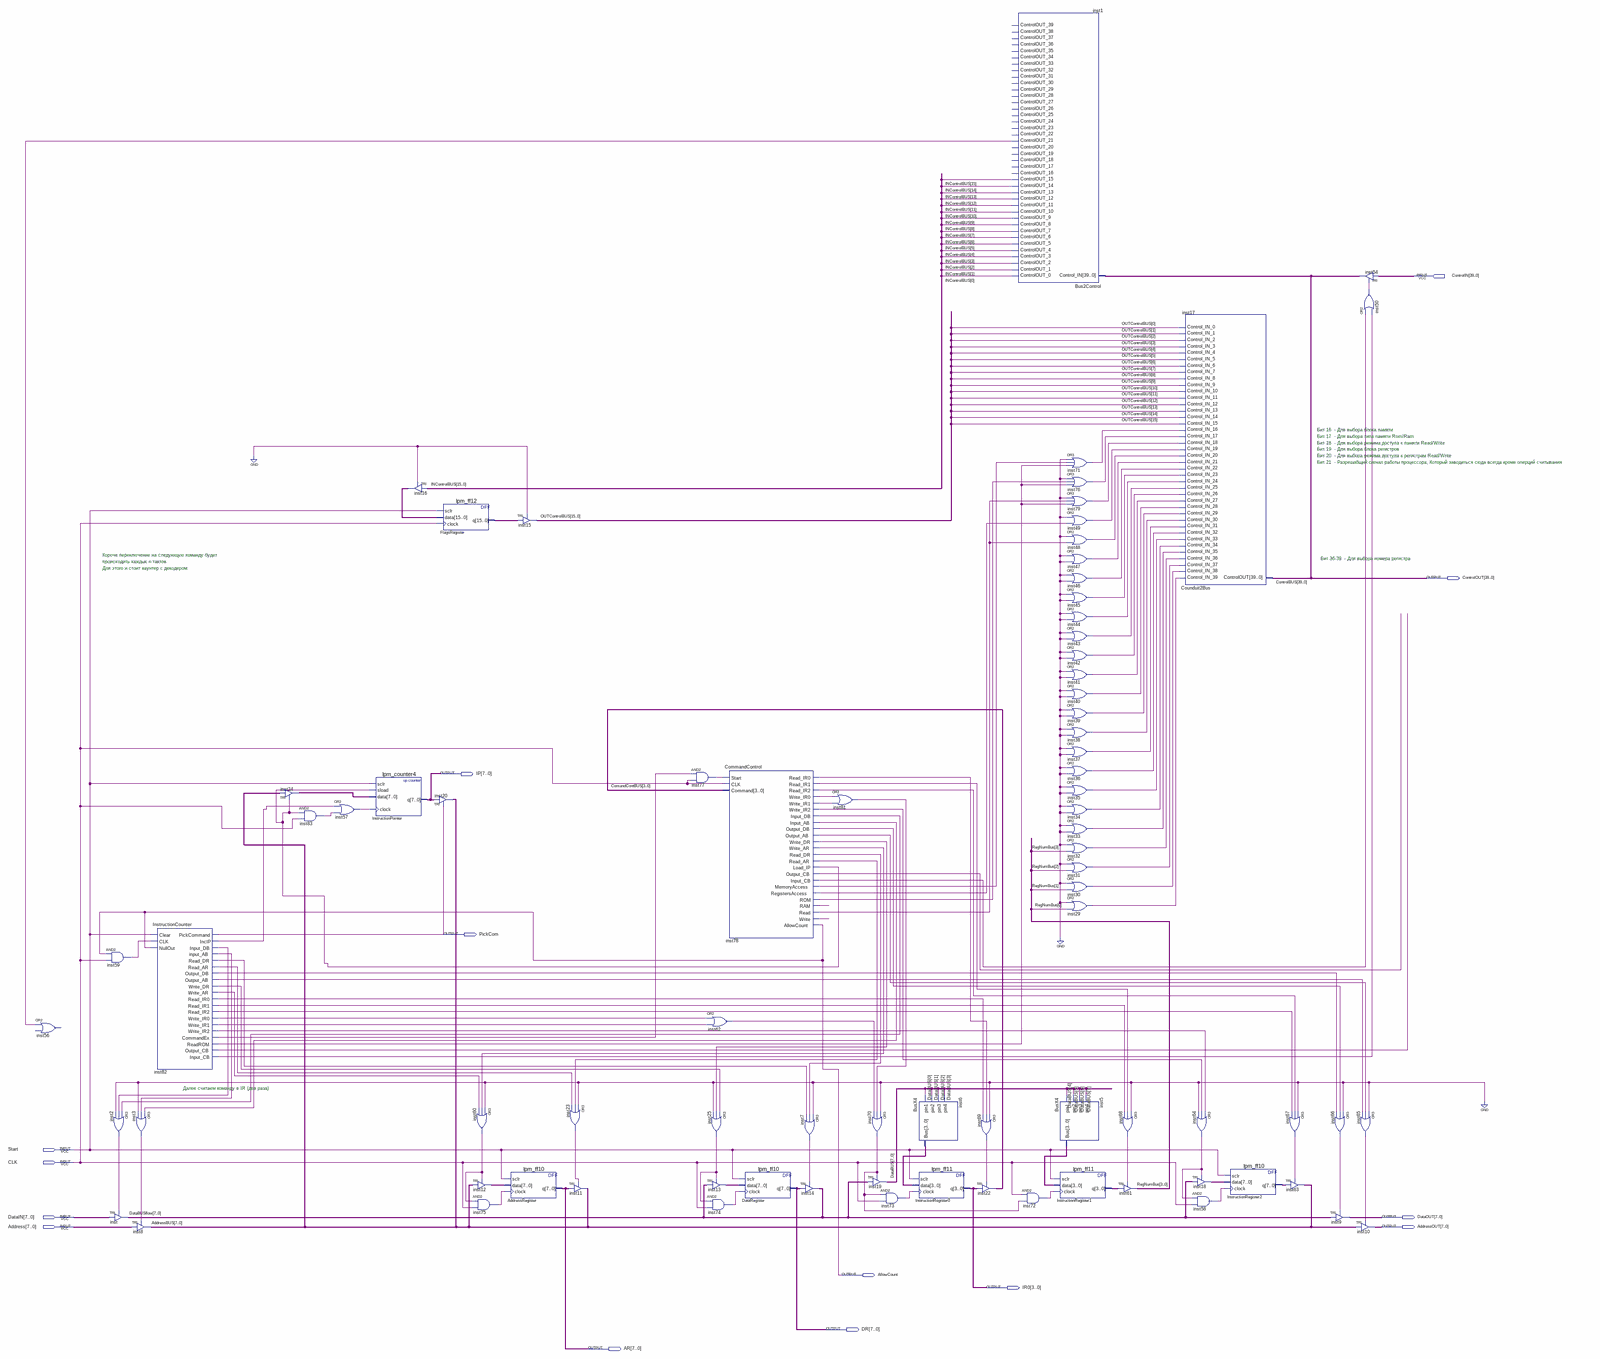
[diagram p0: schematic sheet, whole]
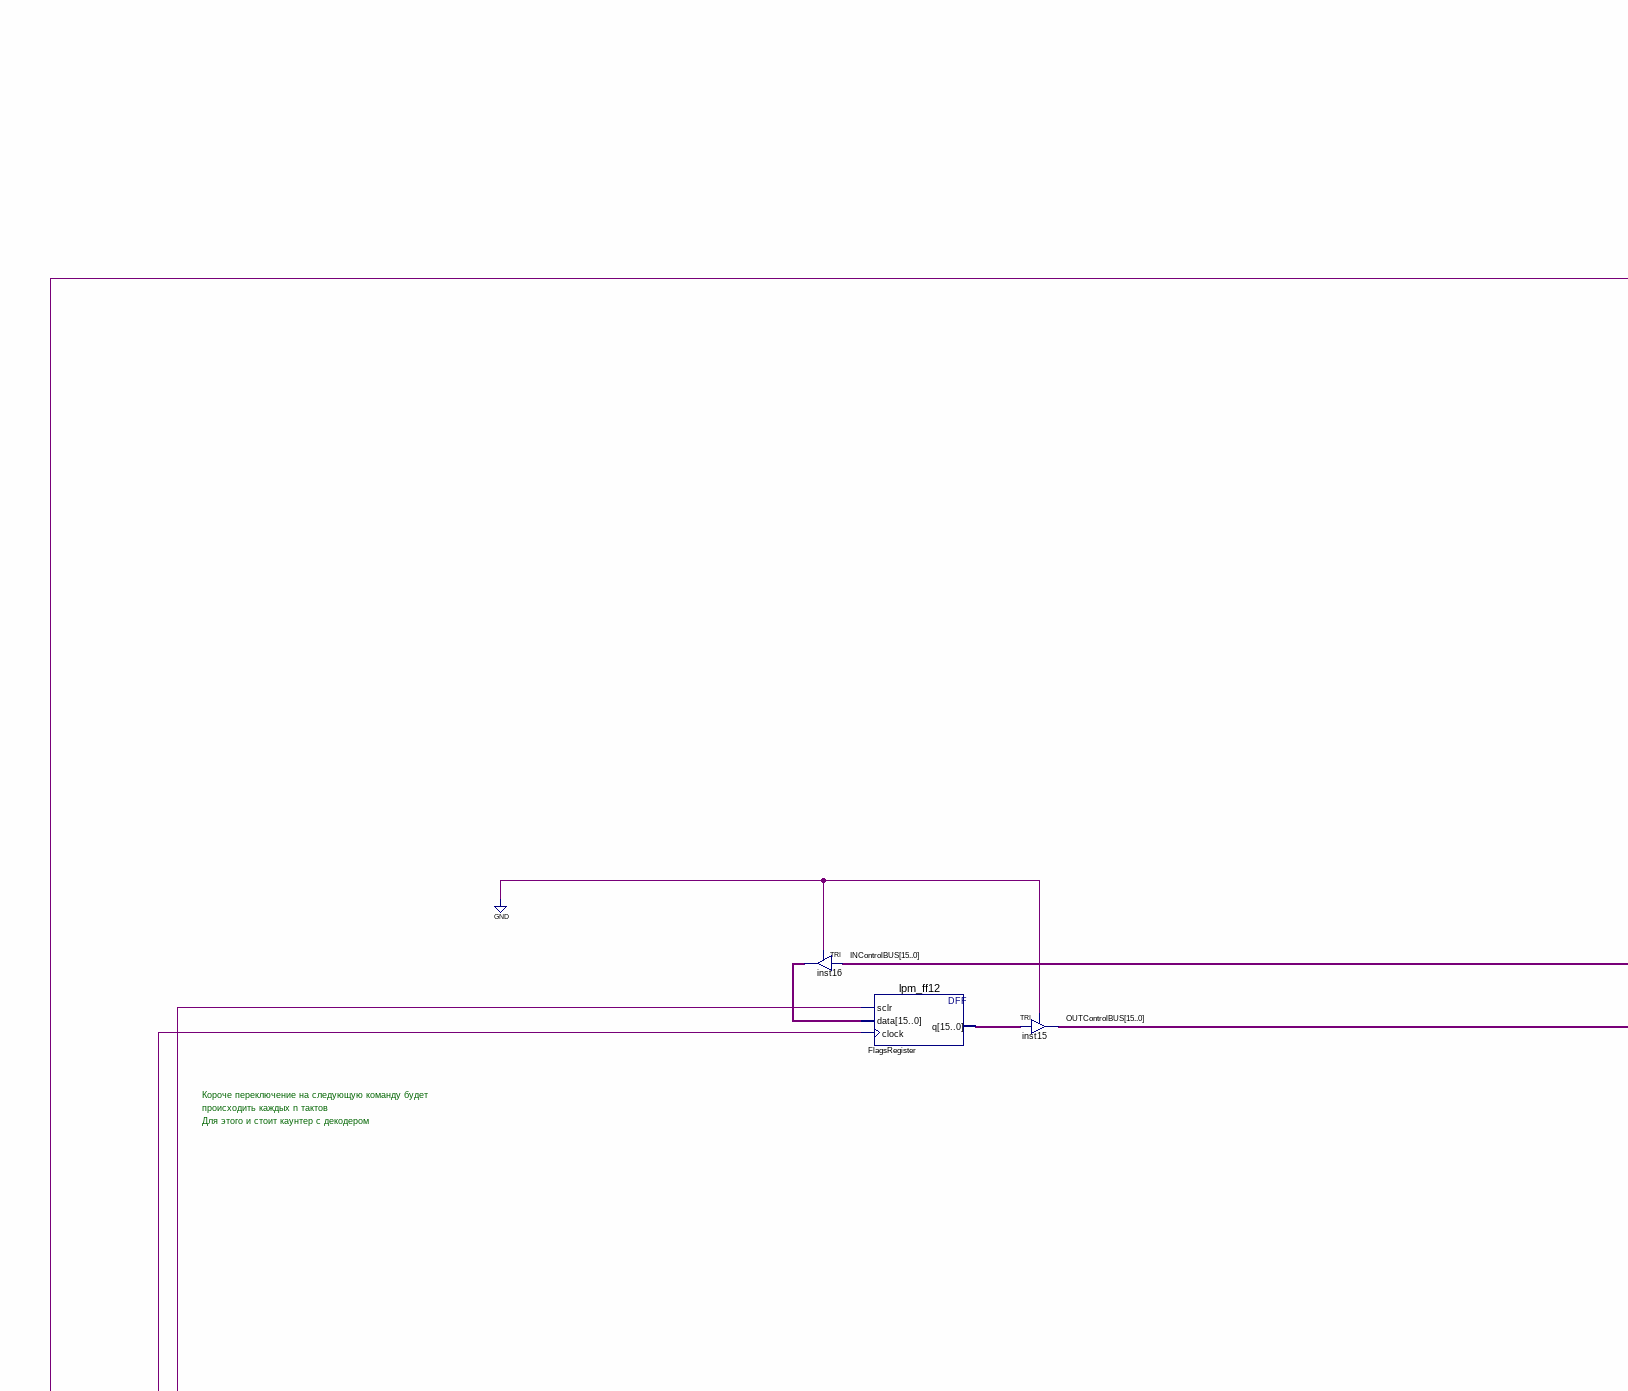
[diagram p1: schematic sheet, upper left part]
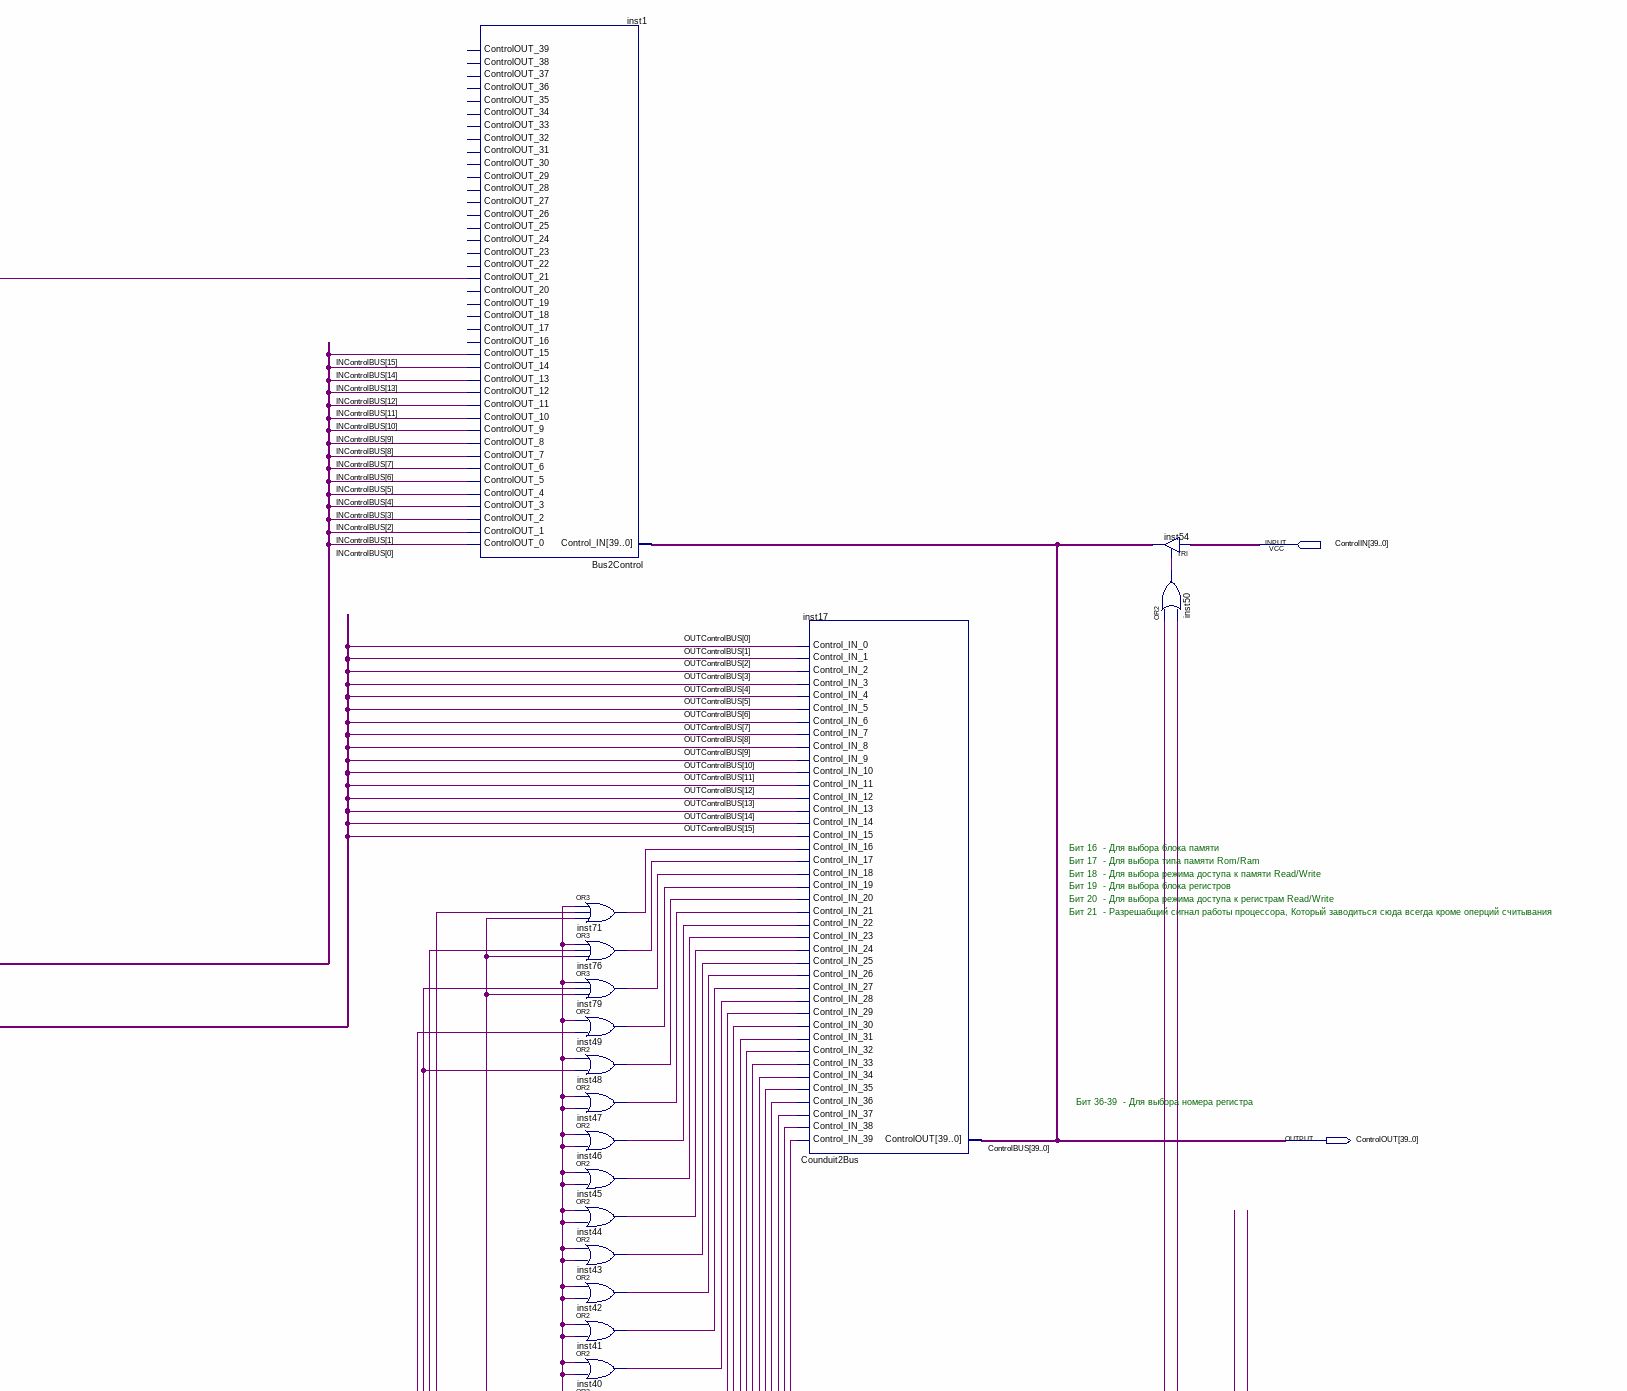
[diagram p2: schematic sheet, upper right part]
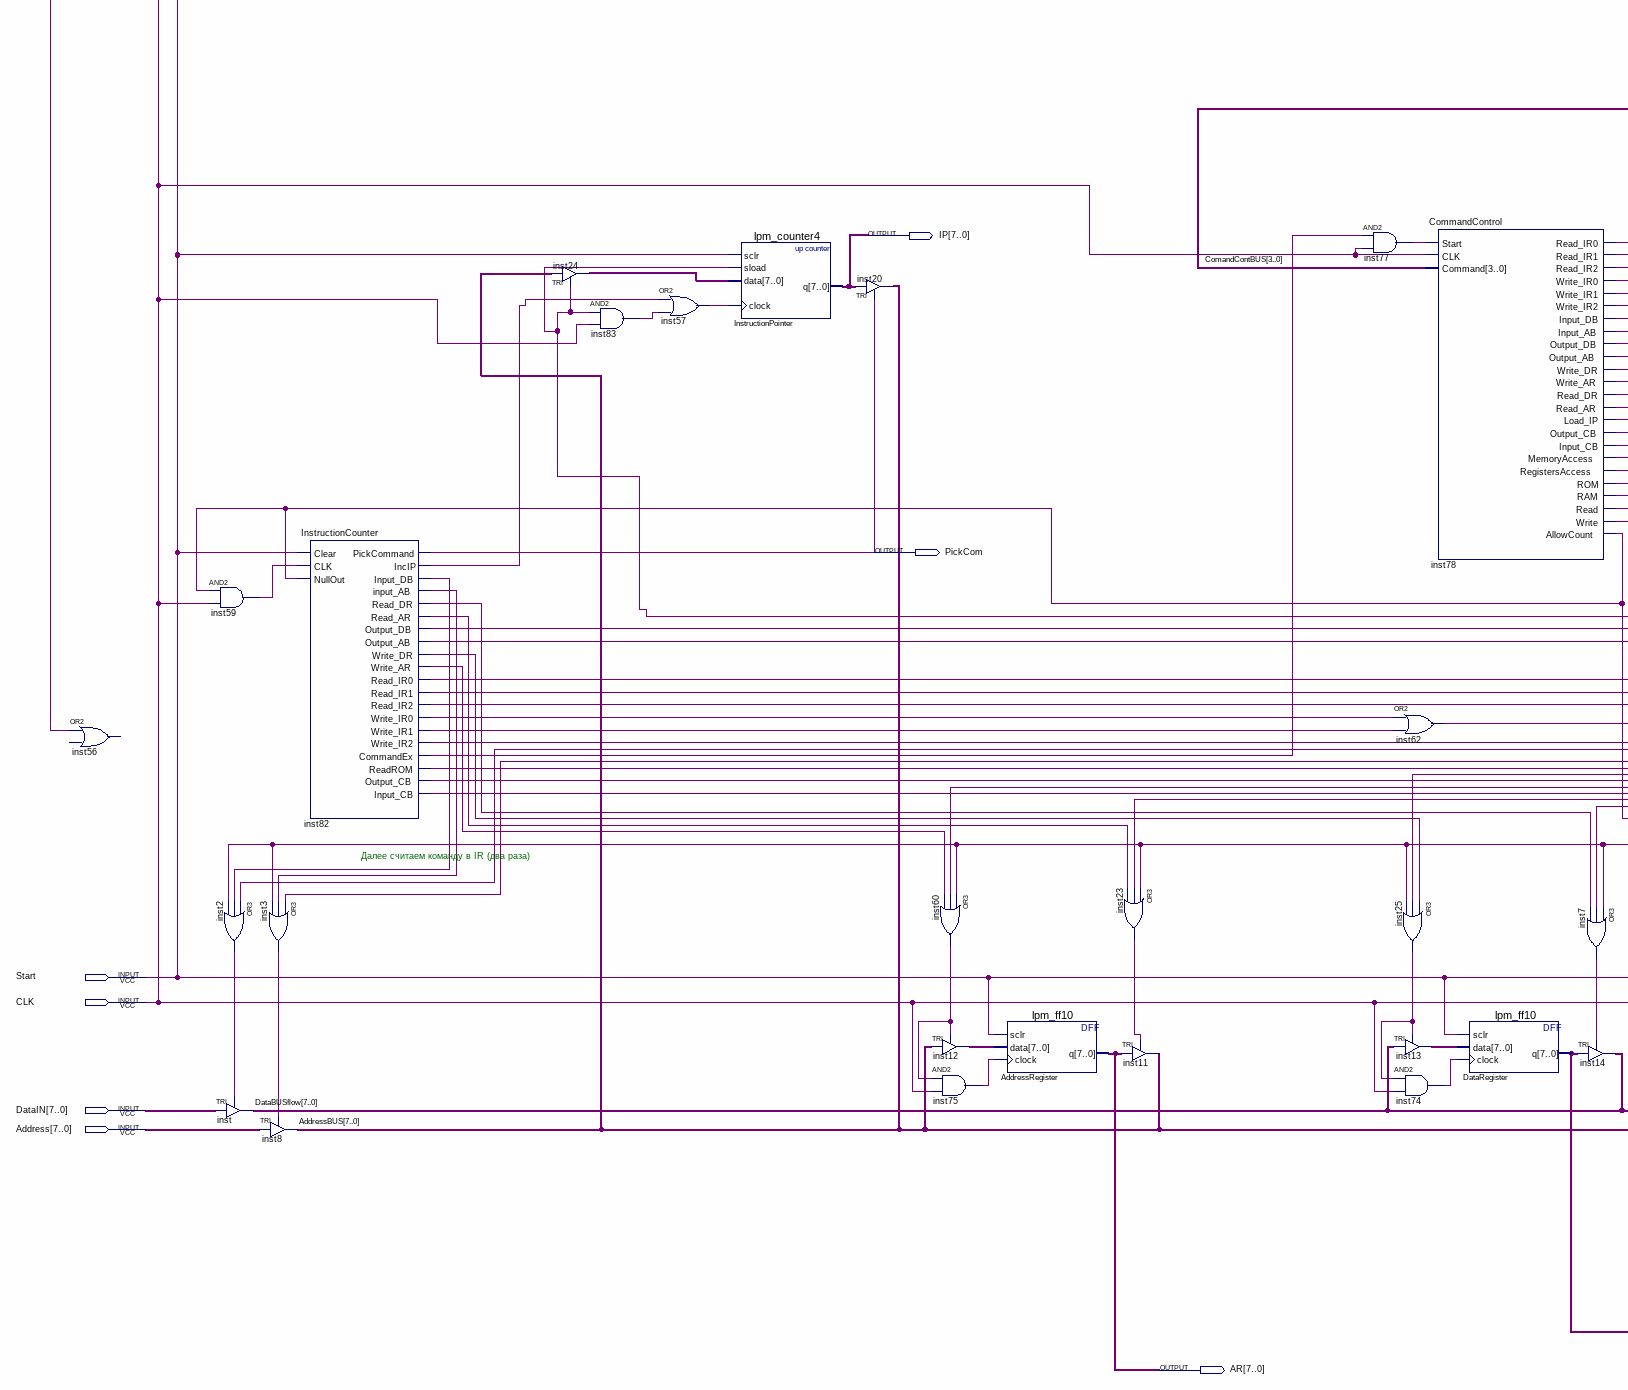
[diagram p3: schematic sheet, lower left part]
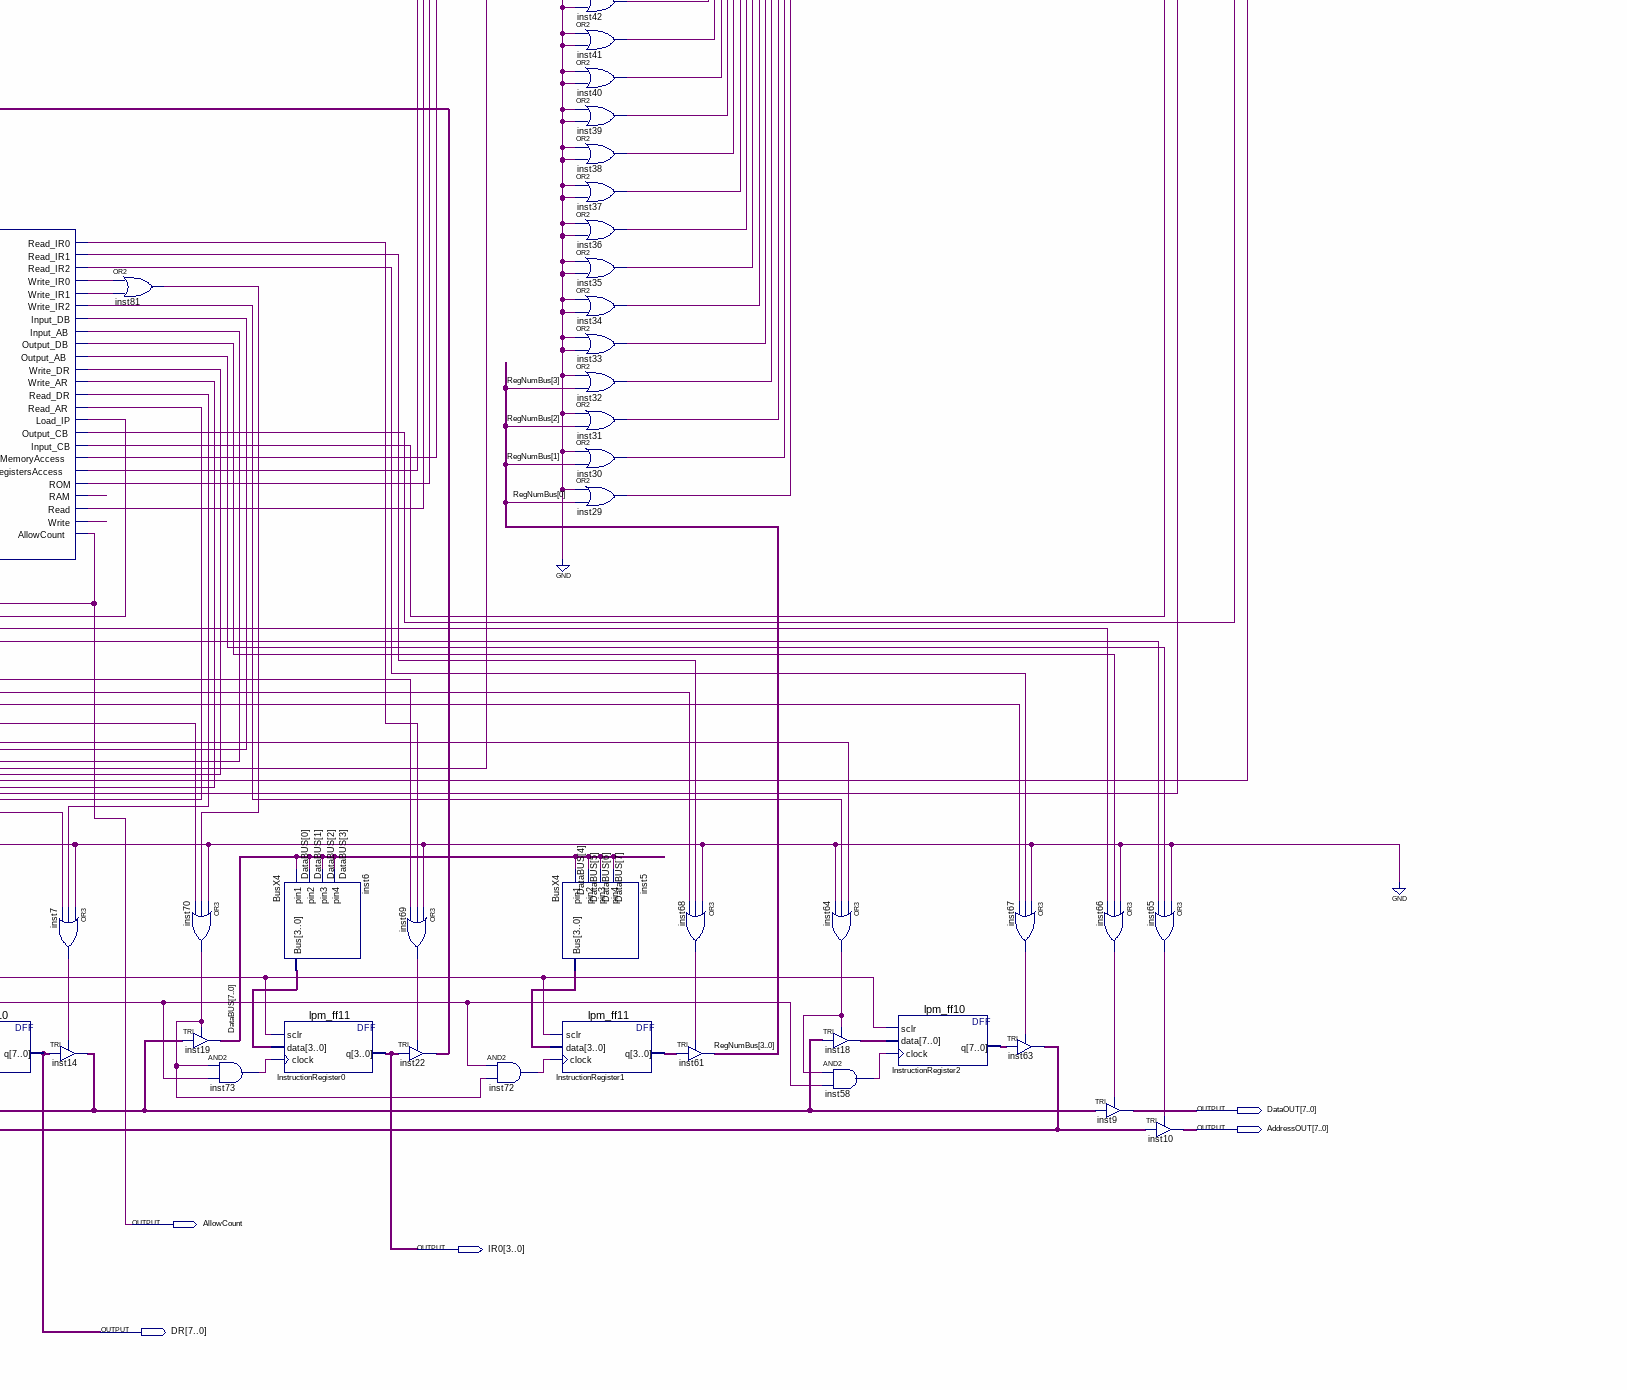
[diagram p4: schematic sheet, lower right part]
// Quartus schematic Control.bdf as structural Verilog: 81 symbols, 14 pins
module Control (
  input  [39:0] ControlIN,
  input  Start,
  input  CLK,
  input  [7:0] DataIN,
  input  [7:0] Address,
  output [39:0] ControlOUT,
  output [7:0] IP,
  output PickCom,
  output [7:0] DataOUT,
  output [7:0] AddressOUT,
  output AllowCount,
  output [3:0] IR0,
  output [7:0] DR,
  output [7:0] AR
);

  wire inst1_controlout_21, inst2_out, inst3_out, inst7_out, inst23_out, inst25_out, inst29_out, inst30_out,
       inst31_out, inst32_out, inst33_out, inst34_out, inst35_out, inst36_out, inst37_out, inst38_out,
       inst39_out, inst40_out, inst41_out, inst42_out, inst43_out, inst44_out, inst45_out, inst46_out,
       inst47_out, inst48_out, inst49_out, inst50_out, inst57_out, inst58_out, inst59_out, inst60_out,
       inst62_out, inst64_out, inst65_out, inst66_out, inst67_out, inst68_out, inst69_out, inst70_out,
       inst71_out, inst72_out, inst73_out, inst74_out, inst75_out, inst76_out, inst77_out, inst78_input_ab,
       inst78_input_cb, inst78_input_db, inst78_load_ip, inst78_memoryaccess, inst78_output_ab,
       inst78_output_cb, inst78_output_db, inst78_ram, inst78_read, inst78_read_ar, inst78_read_dr,
       inst78_read_ir0, inst78_read_ir1, inst78_read_ir2, inst78_registersaccess, inst78_rom, inst78_write,
       inst78_write_ar, inst78_write_dr, inst78_write_ir0, inst78_write_ir1, inst78_write_ir2, inst79_out,
       inst81_out, inst82_commandex, inst82_incip, inst82_input_ab, inst82_input_cb, inst82_input_db,
       inst82_output_ab, inst82_output_cb, inst82_output_db, inst82_read_ar, inst82_read_dr, inst82_read_ir0,
       inst82_read_ir1, inst82_read_ir2, inst82_readrom, inst82_write_ar, inst82_write_dr, inst82_write_ir0,
       inst82_write_ir1, inst82_write_ir2, inst83_out;
  wire [3:0] ComandContBUS, inst5_bus, inst6_bus, InstructionRegister1_q, RegNumBus;
  wire [7:0] AddressBUS, DataBUS, DataBUSflow, inst12_out, inst13_out, inst18_out, inst24_out,
       InstructionRegister2_q;
  wire [15:0] FlagsRegister_q, INControlBUS, inst16_out, OUTControlBUS;

  // OR2 inst56 has open pins: IN1=inst1_controlout_21, IN2=open, OUT=open
  and inst59 (inst59_out, AllowCount, CLK);
  or inst2 (inst2_out, inst78_input_db, inst82_input_db, 1'b0);
  TRI inst[7:0] (.IN(DataIN), .OE(inst2_out), .OUT(DataBUSflow));
  InstructionCounter inst82 (
    .Clear(Start), .CLK(inst59_out), .NullOut(AllowCount), .PickCommand(PickCom), .IncIP(inst82_incip),
    .Input_DB(inst82_input_db), .input_AB(inst82_input_ab), .Read_DR(inst82_read_dr),
    .Read_AR(inst82_read_ar), .Output_DB(inst82_output_db), .Output_AB(inst82_output_ab),
    .Write_DR(inst82_write_dr), .Write_AR(inst82_write_ar), .Read_IR0(inst82_read_ir0),
    .Read_IR1(inst82_read_ir1), .Read_IR2(inst82_read_ir2), .Write_IR0(inst82_write_ir0),
    .Write_IR1(inst82_write_ir1), .Write_IR2(inst82_write_ir2), .CommandEx(inst82_commandex),
    .ReadROM(inst82_readrom), .Output_CB(inst82_output_cb), .Input_CB(inst82_input_cb));
  or inst3 (inst3_out, inst78_input_ab, inst82_input_ab, 1'b0);
  TRI inst8[7:0] (.IN(Address), .OE(inst3_out), .OUT(AddressBUS));
  TRI inst24[7:0] (.IN(AddressBUS), .OE(inst78_load_ip), .OUT(inst24_out));
  and inst83 (inst83_out, inst78_load_ip, CLK);
  or inst57 (inst57_out, inst82_incip, inst83_out);
  lpm_counter4 InstructionPointer (.sclr(Start), .sload(inst78_load_ip), .data(inst24_out), .clock(inst57_out), .q(IP));
  TRI inst16[15:0] (.IN(INControlBUS), .OE(1'b0), .OUT(inst16_out));
  TRI inst20[7:0] (.IN(IP), .OE(PickCom), .OUT(AddressBUS));
  lpm_ff12 FlagsRegister (.sclr(Start), .data(inst16_out), .clock(CLK), .q(FlagsRegister_q));
  or inst60 (inst60_out, 1'b0, inst78_write_ar, inst82_write_ar);
  TRI inst12[7:0] (.IN(AddressBUS), .OE(inst60_out), .OUT(inst12_out));
  and inst75 (inst75_out, inst60_out, CLK);
  lpm_ff10 AddressRegister (.sclr(Start), .data(inst12_out), .clock(inst75_out), .q(AR));
  TRI inst15[15:0] (.IN(FlagsRegister_q), .OE(1'b0), .OUT(OUTControlBUS));
  or inst23 (inst23_out, 1'b0, inst78_read_ar, inst82_read_ar);
  TRI inst11[7:0] (.IN(AR), .OE(inst23_out), .OUT(AddressBUS));
  and inst77 (inst77_out, inst82_commandex, CLK);
  or inst62 (inst62_out, inst82_write_ir0, inst82_write_ir1);
  or inst25 (inst25_out, inst82_write_dr, inst78_write_dr, 1'b0);
  TRI inst13[7:0] (.IN(DataBUSflow), .OE(inst25_out), .OUT(inst13_out));
  and inst74 (inst74_out, inst25_out, CLK);
  CommandControl inst78 (
    .Start(inst77_out), .CLK(CLK), .Command(ComandContBUS), .Read_IR0(inst78_read_ir0),
    .Read_IR1(inst78_read_ir1), .Read_IR2(inst78_read_ir2), .Write_IR0(inst78_write_ir0),
    .Write_IR1(inst78_write_ir1), .Write_IR2(inst78_write_ir2), .Input_DB(inst78_input_db),
    .Input_AB(inst78_input_ab), .Output_DB(inst78_output_db), .Output_AB(inst78_output_ab),
    .Write_DR(inst78_write_dr), .Write_AR(inst78_write_ar), .Read_DR(inst78_read_dr),
    .Read_AR(inst78_read_ar), .Load_IP(inst78_load_ip), .Output_CB(inst78_output_cb),
    .Input_CB(inst78_input_cb), .MemoryAccess(inst78_memoryaccess), .RegistersAccess(inst78_registersaccess),
    .ROM(inst78_rom), .RAM(inst78_ram), .Read(inst78_read), .Write(inst78_write), .AllowCount(AllowCount));
  lpm_ff10 DataRegister (.sclr(Start), .data(inst13_out), .clock(inst74_out), .q(DR));
  or inst7 (inst7_out, 1'b0, inst78_read_dr, inst82_read_dr);
  TRI inst14[7:0] (.IN(DR), .OE(inst7_out), .OUT(DataBUSflow));
  or inst81 (inst81_out, inst78_write_ir0, inst78_write_ir1);
  or inst70 (inst70_out, 1'b0, inst81_out, inst62_out);
  TRI inst19[7:0] (.IN(DataBUSflow), .OE(inst70_out), .OUT(DataBUS));
  and inst73 (inst73_out, inst70_out, CLK);
  BusX4 inst6 (.pin1(DataBUS[0]), .pin2(DataBUS[1]), .pin3(DataBUS[2]), .pin4(DataBUS[3]), .Bus(inst6_bus));
  lpm_ff11 InstructionRegister0 (.sclr(Start), .data(inst6_bus), .clock(inst73_out), .q(IR0));
  or inst69 (inst69_out, 1'b0, inst78_read_ir0, inst82_read_ir0);
  TRI inst22[3:0] (.IN(IR0), .OE(inst69_out), .OUT(ComandContBUS));
  Bus2Control inst1 (
    .Control_IN(ControlOUT), .ControlOUT_0(INControlBUS[0]), .ControlOUT_1(INControlBUS[1]),
    .ControlOUT_2(INControlBUS[2]), .ControlOUT_3(INControlBUS[3]), .ControlOUT_4(INControlBUS[4]),
    .ControlOUT_5(INControlBUS[5]), .ControlOUT_6(INControlBUS[6]), .ControlOUT_7(INControlBUS[7]),
    .ControlOUT_8(INControlBUS[8]), .ControlOUT_9(INControlBUS[9]), .ControlOUT_10(INControlBUS[10]),
    .ControlOUT_11(INControlBUS[11]), .ControlOUT_12(INControlBUS[12]), .ControlOUT_13(INControlBUS[13]),
    .ControlOUT_14(INControlBUS[14]), .ControlOUT_15(INControlBUS[15]), .ControlOUT_21(inst1_controlout_21));  // open: ControlOUT_16, ControlOUT_17, ControlOUT_18, ControlOUT_19, ControlOUT_20, ControlOUT_22, ControlOUT_23, ControlOUT_24, ControlOUT_25, ControlOUT_26, ControlOUT_27, ControlOUT_28, ControlOUT_29, ControlOUT_30, ControlOUT_31, ControlOUT_32, ControlOUT_33, ControlOUT_34, ControlOUT_35, ControlOUT_36, ControlOUT_37, ControlOUT_38, ControlOUT_39
  and inst72 (inst72_out, CLK, inst70_out);
  or inst71 (inst71_out, 1'b0, inst78_memoryaccess, inst82_readrom);
  or inst76 (inst76_out, 1'b0, inst78_rom, inst82_readrom);
  or inst79 (inst79_out, 1'b0, inst78_read, inst82_readrom);
  or inst49 (inst49_out, 1'b0, inst78_registersaccess);
  or inst48 (inst48_out, 1'b0, inst78_read);
  or inst47 (inst47_out, 1'b0, 1'b0);
  or inst46 (inst46_out, 1'b0, 1'b0);
  or inst45 (inst45_out, 1'b0, 1'b0);
  or inst44 (inst44_out, 1'b0, 1'b0);
  or inst43 (inst43_out, 1'b0, 1'b0);
  or inst42 (inst42_out, 1'b0, 1'b0);
  or inst41 (inst41_out, 1'b0, 1'b0);
  or inst40 (inst40_out, 1'b0, 1'b0);
  or inst39 (inst39_out, 1'b0, 1'b0);
  or inst38 (inst38_out, 1'b0, 1'b0);
  or inst37 (inst37_out, 1'b0, 1'b0);
  or inst36 (inst36_out, 1'b0, 1'b0);
  or inst35 (inst35_out, 1'b0, 1'b0);
  or inst34 (inst34_out, 1'b0, 1'b0);
  or inst33 (inst33_out, 1'b0, 1'b0);
  or inst32 (inst32_out, 1'b0, RegNumBus[3]);
  or inst31 (inst31_out, 1'b0, RegNumBus[2]);
  or inst30 (inst30_out, 1'b0, RegNumBus[1]);
  or inst29 (inst29_out, 1'b0, RegNumBus[0]);
  BusX4 inst5 (.pin1(DataBUS[4]), .pin2(DataBUS[5]), .pin3(DataBUS[6]), .pin4(DataBUS[7]), .Bus(inst5_bus));
  lpm_ff11 InstructionRegister1 (.sclr(Start), .data(inst5_bus), .clock(inst72_out), .q(InstructionRegister1_q));
  or inst68 (inst68_out, 1'b0, inst78_read_ir1, inst82_read_ir1);
  TRI inst61[3:0] (.IN(InstructionRegister1_q), .OE(inst68_out), .OUT(RegNumBus));
  Counduit2Bus inst17 (
    .Control_IN_39(inst29_out), .Control_IN_38(inst30_out), .Control_IN_37(inst31_out),
    .Control_IN_36(inst32_out), .Control_IN_35(inst33_out), .Control_IN_34(inst34_out),
    .Control_IN_33(inst35_out), .Control_IN_32(inst36_out), .Control_IN_31(inst37_out),
    .Control_IN_30(inst38_out), .Control_IN_29(inst39_out), .Control_IN_28(inst40_out),
    .Control_IN_27(inst41_out), .Control_IN_26(inst42_out), .Control_IN_25(inst43_out),
    .Control_IN_24(inst44_out), .Control_IN_23(inst45_out), .Control_IN_22(inst46_out),
    .Control_IN_21(inst47_out), .Control_IN_20(inst48_out), .Control_IN_19(inst49_out),
    .Control_IN_18(inst79_out), .Control_IN_17(inst76_out), .Control_IN_16(inst71_out),
    .Control_IN_15(OUTControlBUS[15]), .Control_IN_14(OUTControlBUS[14]), .Control_IN_13(OUTControlBUS[13]),
    .Control_IN_12(OUTControlBUS[12]), .Control_IN_11(OUTControlBUS[11]), .Control_IN_10(OUTControlBUS[10]),
    .Control_IN_9(OUTControlBUS[9]), .Control_IN_8(OUTControlBUS[8]), .Control_IN_7(OUTControlBUS[7]),
    .Control_IN_6(OUTControlBUS[6]), .Control_IN_5(OUTControlBUS[5]), .Control_IN_4(OUTControlBUS[4]),
    .Control_IN_3(OUTControlBUS[3]), .Control_IN_2(OUTControlBUS[2]), .Control_IN_1(OUTControlBUS[1]),
    .Control_IN_0(OUTControlBUS[0]), .ControlOUT(ControlOUT));
  or inst64 (inst64_out, inst82_write_ir2, inst78_write_ir2, 1'b0);
  TRI inst18[7:0] (.IN(DataBUSflow), .OE(inst64_out), .OUT(inst18_out));
  and inst58 (inst58_out, inst64_out, CLK);
  lpm_ff10 InstructionRegister2 (.sclr(Start), .data(inst18_out), .clock(inst58_out), .q(InstructionRegister2_q));
  or inst67 (inst67_out, 1'b0, inst78_read_ir2, inst82_read_ir2);
  TRI inst63[7:0] (.IN(InstructionRegister2_q), .OE(inst67_out), .OUT(AddressBUS));
  or inst66 (inst66_out, 1'b0, inst78_output_db, inst82_output_db);
  TRI inst9[7:0] (.IN(DataBUSflow), .OE(inst66_out), .OUT(DataOUT));
  TRI inst54[39:0] (.IN(ControlIN), .OE(inst50_out), .OUT(ControlOUT));
  or inst50 (inst50_out, inst78_input_cb, inst82_input_cb);
  or inst65 (inst65_out, 1'b0, inst78_output_ab, inst82_output_ab);
  TRI inst10[7:0] (.IN(AddressBUS), .OE(inst65_out), .OUT(AddressOUT));

  // Other names for the same wires on the sheet: ControlBUS[39:0] = ControlOUT

  // Notes on the sheet:
  //   Бит 16  - Для выбора блока памяти
  //   Бит 17  - Для выбора типа памяти Rom/Ram
  //   Бит 18  - Для выбора режима доступа к памяти Read/Write
  //   Бит 19  - Для выбора блока регистров
  //   Бит 20  - Для выбора режима доступа к регистрам Read/Write
  //   Бит 21  - Разрешабщий сигнал работы процессора, Который заводиться сюда всегда кроме оперций считывания
  //   Короче переключение на следующую команду будет
  //   Бит 36-39  - Для выбора номера регистра
  //   происходить каждых n тактов
  //   Для этого и стоит каунтер с декодером
  //   Далее считаем команду в IR (два раза)
endmodule
